# Altium project GNSS.PrjPCB
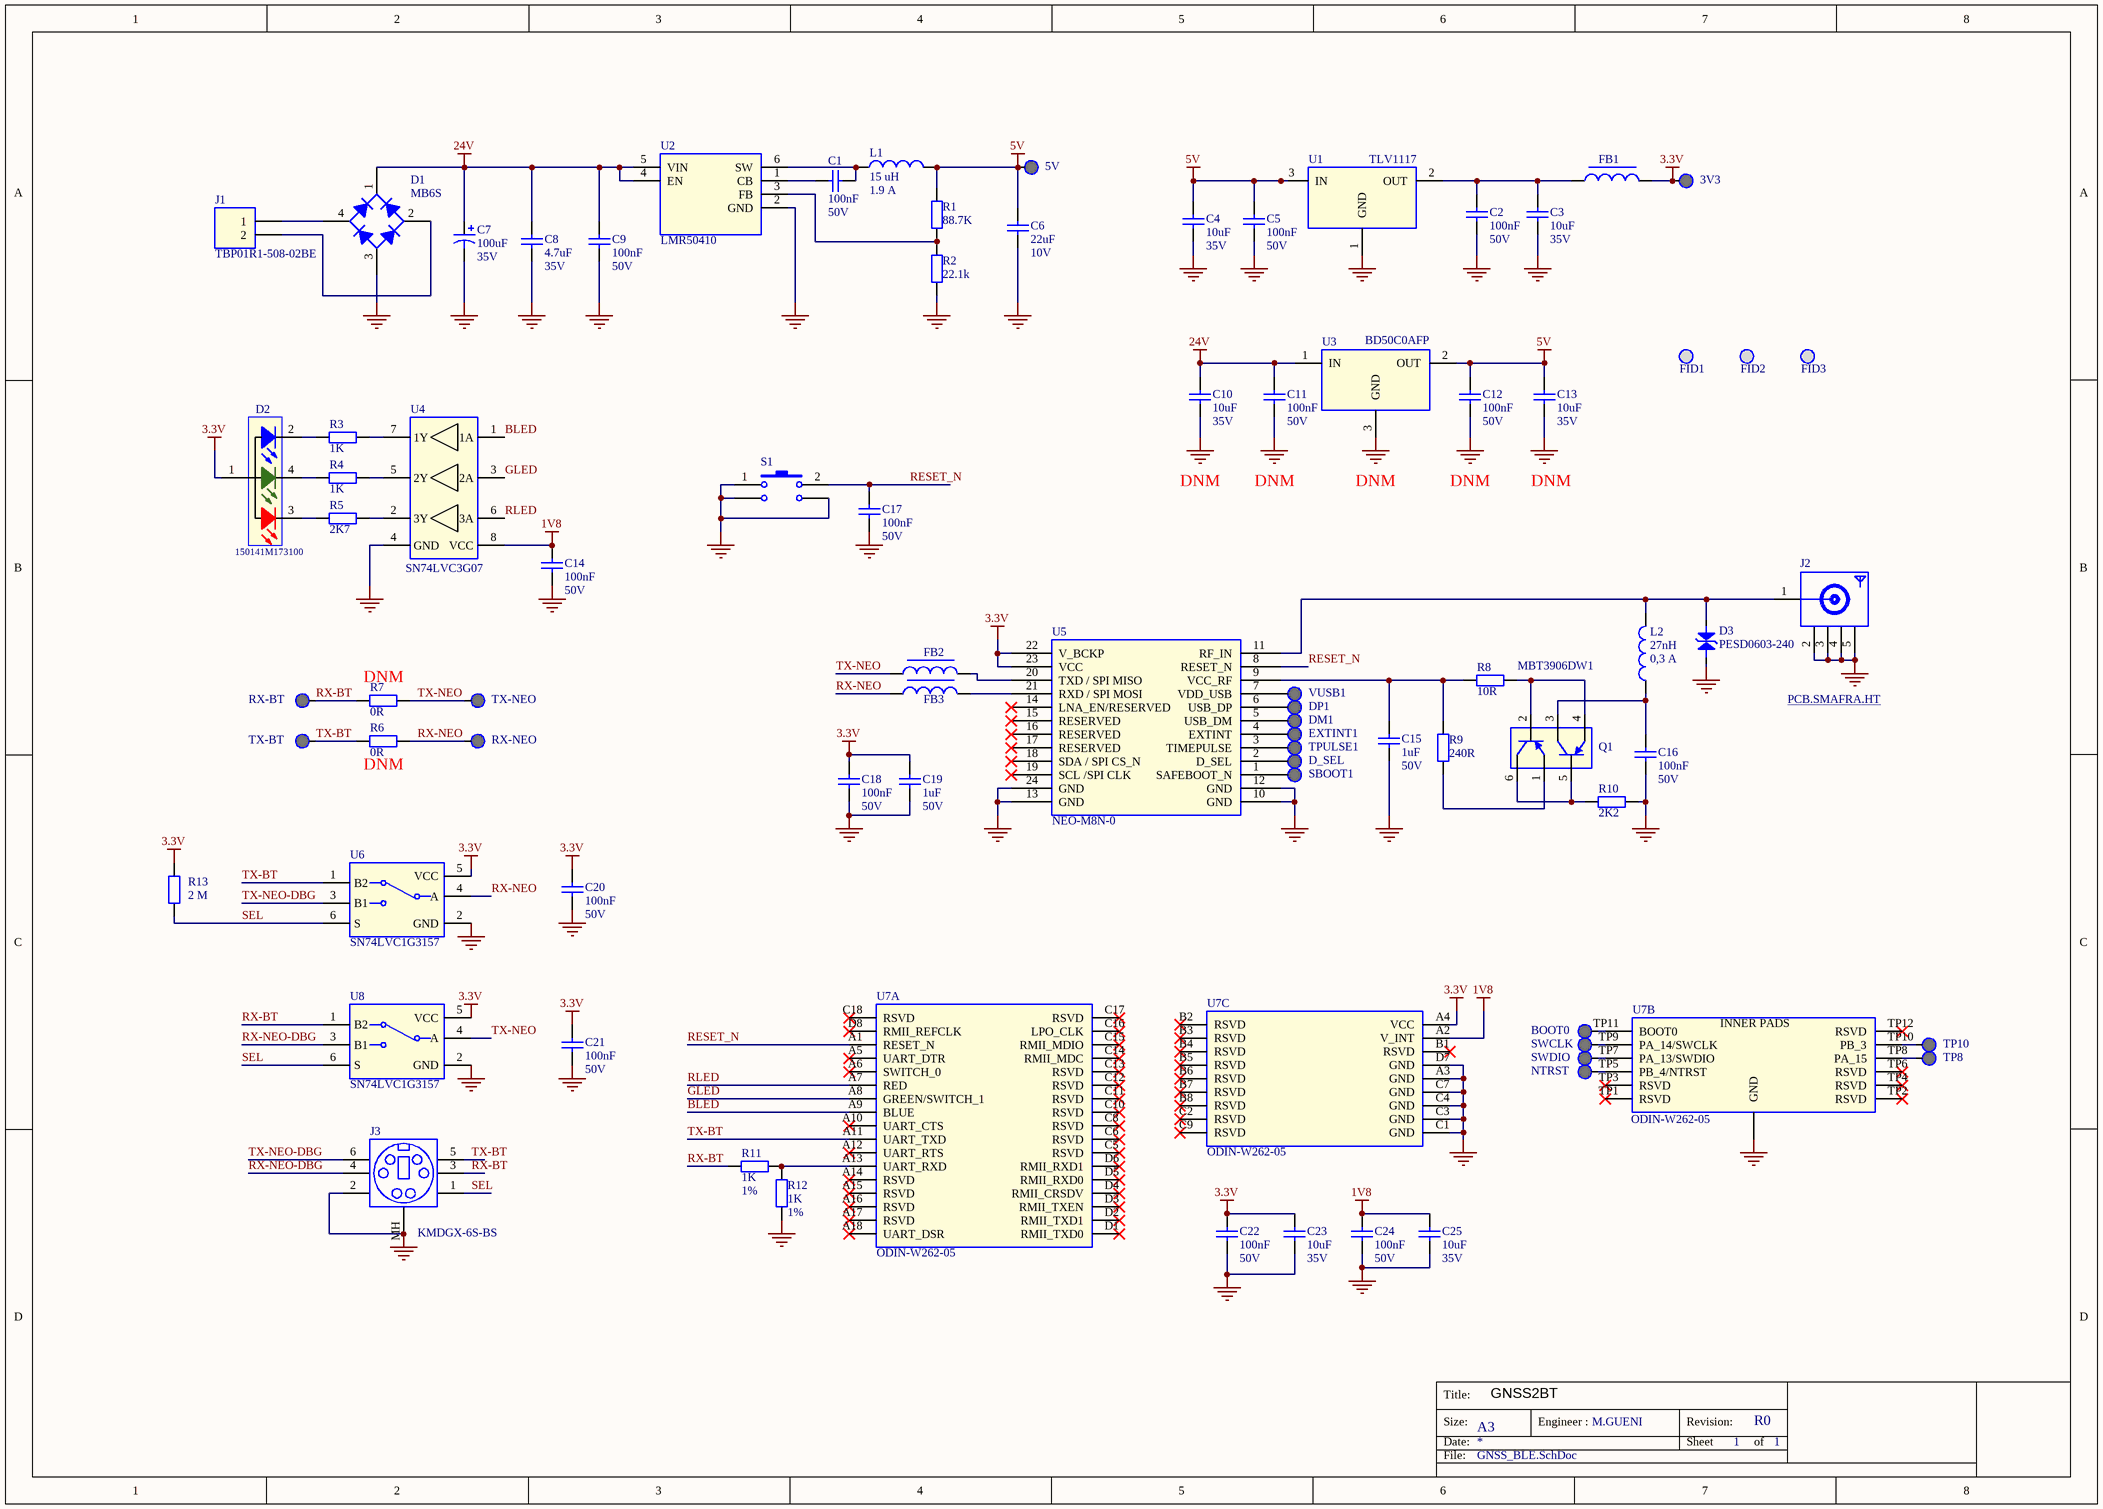
[diagram p0: GNSS_BLE.SchDoc]
CompanyName: Micro-Device Tunisie; DocumentNumber: 1; DocumentScale: 1:1; DrawnBy: MG; SheetTotal: 1; Title: DMX Wifi Bridge
1 sheet, 81 parts. Net scope: global (net labels, ports and power ports of the same name join across sheets).
Board file: GNSS_PCB.PcbDoc

## Sheet GNSS_BLE.SchDoc: DMX Wifi Bridge
size A3; Organization: Altium Limited; Address1: L3, 12a Rodborough Rd; Address2: Frenchs Forest; Address3: NSW; Address4: Australia 2086; Revision: R0; SheetNumber: 5; SheetTotal: 8

### Parts
3V3  Test Point  [TP]  (value not drawn)  (no BOM)
5V  Test Point  [TP]  (value not drawn)  (no BOM)
BOOT0  Test Point  [TP]  (value not drawn)  (no BOM)
C1  Value 1: 100nF  Value 2: 50V  [CAPC1608N]  (hidden comment: C0603C104K5RAC3121)
C2  Value 1: 100nF  Value 2: 50V  [CAPC1608N]  (hidden comment: C0603C104K5RAC3121)
C3  Value 1: 10uF  Value 2: 35V  [CAPC1608N]  (hidden comment: GRM188R6YA106MA73D)
C4  Value 1: 10uF  Value 2: 35V  [CAPC1608N]  (hidden comment: GRM188R6YA106MA73D)
C5  Value 1: 100nF  Value 2: 50V  [CAPC1608N]  (hidden comment: C0603C104K5RAC3121)
C6  Value 1: 22uF  Value 2: 10V  [CAPC1608N]  (hidden comment: GRM188R61A226ME15D)
C7  Value 1: 100uF  Value 2: 35V  [ECAP_SMD_6.3]  (hidden comment: EEEFK1V101XP)
C8  Value 1: 4.7uF  Value 2: 35V  [CAPC1608N]  (hidden comment: GRM188R6YA475KE5D)
C9  Value 1: 100nF  Value 2: 50V  [CAPC1608N]  (hidden comment: C0603C104K5RAC3121)
C10  Value 1: 10uF  Value 2: 35V  [CAPC1608N]  (hidden comment: GRM188R6YA106MA73D)
C11  Value 1: 100nF  Value 2: 50V  [CAPC1608N]  (hidden comment: C0603C104K5RAC3121)
C12  Value 1: 100nF  Value 2: 50V  [CAPC1608N]  (hidden comment: C0603C104K5RAC3121)
C13  Value 1: 10uF  Value 2: 35V  [CAPC1608N]  (hidden comment: GRM188R6YA106MA73D)
C14  Value 1: 100nF  Value 2: 50V  [CAPC1608N]  (hidden comment: C0603C104K5RAC3121)
C15  Value 1: 1uF  Value 2: 50V  [CAPC1608N]  (hidden comment: GRT188R61H105KE13D)
C16  Value 1: 100nF  Value 2: 50V  [CAPC1608N]  (hidden comment: C0603C104K5RAC3121)
C17  Value 1: 100nF  Value 2: 50V  [CAPC1608N]  (hidden comment: C0603C104K5RAC3121)
C18  Value 1: 100nF  Value 2: 50V  [CAPC1608N]  (hidden comment: C0603C104K5RAC3121)
C19  Value 1: 1uF  Value 2: 50V  [CAPC1608N]  (hidden comment: GRT188R61H105KE13D)
C20  Value 1: 100nF  Value 2: 50V  [CAPC1608N]  (hidden comment: C0603C104K5RAC3121)
C21  Value 1: 100nF  Value 2: 50V  [CAPC1608N]  (hidden comment: C0603C104K5RAC3121)
C22  Value 1: 100nF  Value 2: 50V  [CAPC1608N]  (hidden comment: C0603C104K5RAC3121)
C23  Value 1: 10uF  Value 2: 35V  [CAPC1608N]  (hidden comment: GRM188R6YA106MA73D)
C24  Value 1: 100nF  Value 2: 50V  [CAPC1608N]  (hidden comment: C0603C104K5RAC3121)
C25  Value 1: 10uF  Value 2: 35V  [CAPC1608N]  (hidden comment: GRM188R6YA106MA73D)
D1  MB6S  [MB6S]
D2  150141M173100  [150141M173100]
D3  PESD0603-240  [TVS1608]
D_SEL  Test Point  [TP]  (value not drawn)  (no BOM)
DM1  Test Point  [TP]  (value not drawn)  (no BOM)
DP1  Test Point  [TP]  (value not drawn)  (no BOM)
EXTINT1  Test Point  [TP]  (value not drawn)  (no BOM)
FB1  2512067007Y3  [FB3216]  (value not drawn)
FB2  BLM21BD102SZ1D  [FB2012]  (value not drawn)
FB3  BLM21BD102SZ1D  [FB2012]  (value not drawn)
FID1  Fiducial  [FIDUCIAL-1MM]  (value not drawn)
FID2  Fiducial  [FIDUCIAL-1MM]  (value not drawn)
FID3  Fiducial  [FIDUCIAL-1MM]  (value not drawn)
J1  TBP01R1-508-02BE  [CUI_TBP01R1-508-02BE]
J2  PCB.SMAFRA.HT  [PCB.SMAFRA.HT]
J3  KMDGX-6S-BS  [KMDGX6SBS]
L1  Value 1: 15 uH  Value 2: 1.9 A  [IND4020]  (hidden comment: 74438356150)
L2  Value 1: 27nH  Value 2: 0,3 A  [IND1608N]  (hidden comment: L0603C27NJRMST)
NTRST  Test Point  [TP]  (value not drawn)  (no BOM)
Q1  MBT3906DW1  [SOT-363-6]
R1  Value 1: 88.7K  [RESC1608N]  (hidden comment: CR0603-FX-8872ELF)
R2  Value 1: 22.1k  [RESC1608N]  (hidden comment: CRCW060322K1FKEA)
R3  Value 1: 1K  [RESC1608N]  (hidden comment: ERJ-3GEYJ102V)
R4  Value 1: 1K  [RESC1608N]  (hidden comment: ERJ-3GEYJ102V)
R5  Value 1: 2K7  [RESC1608N]  (hidden comment: RC0603JR-072K7L)
R6  Value 1: 0R  [RESC1608N]  (hidden comment: MCT06030Z0000ZP500)
R7  Value 1: 0R  [RESC1608N]  (hidden comment: MCT06030Z0000ZP500)
R8  Value 1: 10R  [RESC1608N]  (hidden comment: CRCW060310R0FKEAC)
R9  Value 1: 240R  [RESC1608N]  (hidden comment: CRCW0603240RFKEA)
R10  Value 1: 2K2  [RESC1608N]  (hidden comment: RC0603JR-072K2L)
R11  Value 1: 1K  TOL: 1%  [RESC1608N]  (hidden comment: ERJ-3GEYJ102V)
R12  Value 1: 1K  TOL: 1%  [RESC1608N]  (hidden comment: ERJ-3GEYJ102V)
R13  Value 1: 2 M  [RESC1608N]  (hidden comment: MCT06030C2004FP500)
RX-BT  Test Point  [TP]  (value not drawn)  (no BOM)
RX-NEO  Test Point  [TP]  (value not drawn)  (no BOM)
S1  1825027-8  [218250270]  (value not drawn)
SBOOT1  Test Point  [TP]  (value not drawn)  (no BOM)
SWCLK  Test Point  [TP]  (value not drawn)  (no BOM)
SWDIO  Test Point  [TP]  (value not drawn)  (no BOM)
TP8  Test Point  [TP]  (value not drawn)  (no BOM)
TP10  Test Point  [TP]  (value not drawn)  (no BOM)
TPULSE1  Test Point  [TP]  (value not drawn)  (no BOM)
TX-BT  Test Point  [TP]  (value not drawn)  (no BOM)
TX-NEO  Test Point  [TP]  (value not drawn)  (no BOM)
U1  TLV1117  [SOT223]
U2  LMR50410  [SOT-23-6]
U3  BD50C0AFP  [TO-252-3]
U4  SN74LVC3G07  [VSSOP-8]
U5  NEO-M8N-0  [NEO-M8N]
U6  SN74LVC1G3157  [SOT-23-6]
U7  ODIN-W262-05  [ODIN-W26]  (parts A,B,C of 3)
U8  SN74LVC1G3157  [SOT-23-6]
VUSB1  Test Point  [TP]  (value not drawn)  (no BOM)

### Nets
1V8: C14.1 C24.2 C25.2 U4.8(VCC) U7.A2(V_INT)
3.3V: 3V3.1 C18.1 C19.1 C20.2 C21.2 C22.2 C23.2 D2.1(A) FB1.2 R13.2 U5.22(V_BCKP) U5.23(VCC) U6.5(VCC) U7.A4(VCC) U8.5(VCC)
5V: 5V.1 C4.1 C5.1 C6.1 C12.1 C13.2 L1.2 R1.1 U1.3(IN) U3.2(OUT)
24V: C7.1 C8.1 C9.1 C10.1 C11.2 D1.1(K) U2.4(EN) U2.5(VIN) U3.1(IN)
GND: C2.2 C3.2 C4.2 C5.2 C6.2 C7.2 C8.2 C9.2 C10.2 C11.1 C12.2 C13.1 C14.2 C15.2 C16.1 C17.2 C18.2 C19.2 C20.1 C21.1 C22.1 C23.1 C24.1 C25.1 D1.3(A) D3.1 J2.2 J2.3 J2.4 J2.5 J3.2 J3.MH R2.2 R10.1 R12.1 S1.1 S1.MH U1.1(GND) U2.2(GND) U3.3(GND) U4.4(GND) U5.10(GND) U5.12(GND) U5.13(GND) U5.24(GND) U6.2(GND) U7.A3(GND) U7.C1(GND) U7.C3(GND) U7.C4(GND) U7.C7(GND) U7.D7(GND) U7.GND U8.2(GND)
BLED: U4.1(1A) U7.A9(BLUE)
GLED: U4.3(2A) U7.A8(GREEN/SWITCH_1)
RESET_N: C17.1 S1.2 U5.8(RESET_N) U7.A1(RESET_N)
RLED: U4.6(3A) U7.A7(RED)
RX-BT: J3.3 R7.2 R11.1 RX-BT.1 U8.1(B2)
RX-NEO: FB3.1 R6.1 RX-NEO.1 U6.4(A)
RX-NEO-DBG: J3.4 U8.3(B1)
SEL: J3.1 R13.1 U6.6(S) U8.6(S)
TX-BT: J3.5 R6.2 TX-BT.1 U6.1(B2) U7.A11(UART_TXD)
TX-NEO: FB2.1 R7.1 TX-NEO.1 U8.4(A)
TX-NEO-DBG: J3.6 U6.3(B1)
NetBOOT0_1: BOOT0.1 U7.TP11(BOOT0)
NetC1_1: C1.1 U2.1(CB)
NetC1_2: C1.2 L1.1 U2.6(SW)
NetC2_1: C2.1 C3.1 FB1.1 U1.2(OUT)
NetC15_1: C15.1 R8.1 R9.1 U5.9(VCC_RF)
NetC16_2: C16.2 L2.1 Q1.3(C1)
NetD1_2: D1.2(C) J1.2
NetD1_4: D1.4(C) J1.1
NetD2_2: D2.2(K) R3.2
NetD2_3: D2.3(K) R5.2
NetD2_4: D2.4(K) R4.2
NetD3_2: D3.2(K1A2) J2.1 L2.2 U5.11(RF_IN)
NetD_SEL_1: D_SEL.1 U5.2(D_SEL)
NetDM1_1: DM1.1 U5.5(USB_DM)
NetDP1_1: DP1.1 U5.6(USB_DP)
NetEXTINT1_1: EXTINT1.1 U5.4(EXTINT)
NetFB2_2: FB2.2 U5.20(TXD_/_SPI_MISO)
NetFB3_2: FB3.2 U5.21(RXD_/_SPI_MOSI)
NetNTRST_1: NTRST.1 U7.TP5(PB_4/NTRST)
NetQ1_1: Q1.1(E2) R9.2
NetQ1_2: Q1.2(B2) Q1.4(E1) R8.2
NetQ1_5: Q1.5(B1) Q1.6(C2) R10.2
NetR1_2: R1.2 R2.1 U2.3(FB)
NetR3_1: R3.1 U4.7(1Y)
NetR4_1: R4.1 U4.5(2Y)
NetR5_1: R5.1 U4.2(3Y)
NetR11_2: R11.2 R12.2 U7.A13(UART_RXD)
NetSBOOT1_1: SBOOT1.1 U5.1(SAFEBOOT_N)
NetSWCLK_1: SWCLK.1 U7.TP9(PA_14/SWCLK)
NetSWDIO_1: SWDIO.1 U7.TP7(PA_13/SWDIO)
NetTP8_1: TP8.1 U7.TP8(PA_15)
NetTP10_1: TP10.1 U7.TP10(PB_3)
NetTPULSE1_1: TPULSE1.1 U5.3(TIMEPULSE)
NetU5_7: U5.7(VDD_USB) VUSB1.1

Not connected (* = marked no-connect by the designer): U5 14(LNA_EN/RESERVED)* 15(RESERVED)* 16(RESERVED)* 17(RESERVED)* 18(SDA_/_SPI_CS_N)* 19(SCL_/SPI_CLK)*; U7 A5(UART_DTR)* A6(SWITCH_0)* A10(UART_CTS)* A12(UART_RTS)* A14(RSVD)* A15(RSVD)* A16(RSVD)* A17(RSVD)* A18(UART_DSR)* B1(RSVD)* B2(RSVD)* B3(RSVD)* B4(RSVD)* B5(RSVD)* B6(RSVD)* B7(RSVD)* B8(RSVD)* C2(RSVD)* C5(RSVD)* C6(RSVD)* C8(RSVD)* C9(RSVD)* C10(RSVD)* C11(RSVD)* C12(RSVD)* C13(RSVD)* C14(RMII_MDC)* C15(RMII_MDIO)* C16(LPO_CLK)* C17(RSVD)* C18(RSVD)* D1(RMII_TXD0)* D2(RMII_TXD1)* D3(RMII_TXEN)* D4(RMII_CRSDV)* D5(RMII_RXD0)* D6(RMII_RXD1)* D8(RMII_REFCLK)* TP1(RSVD)* TP2(RSVD)* TP3(RSVD)* TP4(RSVD)* TP6(RSVD)* TP12(RSVD)*

### Notes on the sheet
- DNM
- (near R7) DNM
- (near R6) DNM
- Title:
- GNSS2BT
- Size:
- Date:
- File:
- A3
- Engineer :
- M.GUENI
- Revision:
- Sheet
- 1
- R0
- of
- Title
- Number:
- Time:
- (in symbol RFC-000000002, part B) INNER PADS

### Library data of the parts
3V3 5V BOOT0 D_SEL DM1 DP1 EXTINT1 NTRST RX-BT RX-NEO SBOOT1 SWCLK SWDIO TP8 TP10 TPULSE1 TX-BT TX-NEO VUSB1 = MIS-000000001: MAN: _; Part Number: MIS-000000001; MANREF: _; DES: _; Value 1: _; Value 2: _; TOL: _; FTP: _; SUP: _; SUPREF: _; NOTE: _
C1 C2 C5 C9 C11 C12 C14 C16-C18 C20-C22 C24 = CAP-000000001: MAN: KEMET; DES: Condensateurs céramique multicouches MLCC - CMS 50V .1uF X7R 0603 10% AEC-Q200; TOL: 10%; FTP: 0603; SUP: Mouser; SUPREF: 80-C603C104K5RAC3121; NOTE: _; Part Number: CAP-000000001; MANREF: C0603C104K5RAC3121
C3 C4 C10 C13 C23 C25 = CAP-000000003: MAN: Murata Electronics; DES: Multilayer Ceramic Capacitors MLCC - SMD/SMT 0603 10uF 35volts *Derate Voltage/Temp; TOL: 20%; FTP: 0603; SUP: Mouser; SUPREF: 81-GRM188R6YA106MA3D; NOTE: _; Part Number: CAP-000000003; MANREF: GRM188R6YA106MA73D
C6 = CAP-000000006: MAN: Murata Electronics; DES: Multilayer Ceramic Capacitors MLCC - SMD/SMT 0603 22uF 10volts *Derate Voltage/Temp; TOL: 20%; FTP: 0603; SUP: Mouser; SUPREF: 81-GRM188R61A226ME5D; NOTE: _; Part Number: CAP-000000006; MANREF: GRM188R61A226ME15D
C7 = CAP-000000001: MAN: PANASONIC; DES: PANASONIC ELECTRONIC COMPONENTS  EEEFK1V101XP  CONDENSATEUR ELEC ALU 100UF 35V CMS; TOL: 20%; FTP: SMD Size D8; SUP: Mouser; SUPREF: 667-EEE-FK1V101XP / V101XP; NOTE: _; Part Number: CAP-000000001; MANREF: EEEFK1V101XP
C8 = CAP-000000005: MAN: Murata Electronics; DES: Multilayer Ceramic Capacitors MLCC - SMD/SMT 4.7UF 16V 10% 0603; TOL: 10%; FTP: 0603; SUP: Mouser; SUPREF: 81-GRM188R6YA475KE5D; NOTE: _; Part Number: CAP-000000005; MANREF: GRM188R6YA475KE5D
C15 C19 = CAP-000000004: MAN: Murata Electronics; DES: Condensateurs céramique multicouches MLCC - CMS 0603 50Vdc 1.0uF X5R 10%; TOL: 10%; FTP: 0603; SUP: Mouser; SUPREF: 81-GRT188R61H105KE3D; NOTE: _; Part Number: CAP-000000004; MANREF: GRT188R61H105KE13D
D1 = DIB-000000001: MAN: Micro Commercial Components (MCC); MANREF: MB6S-TP; DES: Redresseurs en pont .5A 600V; Value 1: 0.5A; Value 2: 600V; TOL: _; FTP: MBS-1; SUP: Mouser; SUPREF: 833-MB6S-TP; Part Number: DIB-000000001; NOTE: _
D2 = LED-000000001: MAN: Wurth Elektronik; DES: WL-SFTW SMD Full-color TOP LED Waterclear, size 5050, Red & Green & Blue, 120deg; Value 1: 20 mA; Value 2: 2 V, 3.2 V, 3.2 V; TOL: _; FTP: 1411 (3528 metric); SUP: Mouser; SUPREF: 710-150141M173100; Part Number: LED-000000001; MANREF: 150141M173100; NOTE: _
D3 = TVS-000000001: MAN: Littelfuse; Value 1: 24 V; Value 2: 0.25pF; TOL: _; FTP: 0603; SUP: Mouser; SUPREF: 650-PESD0603-240; DES: ESD Suppressors / TVS Diodes 0.25pFA 24V 0603 AEC-Q200; Part Number: TVS-000000001; MANREF: PESD0603-240; NOTE: _
FB1 = FER-000000001: MAN: FAIR-RITE; DES: 2512067007Y3 -  Perle de ferrite, 1206 [3216 Metric], 70 ohm, 3 A, 0.04 ohm, ± 25%; Value 1: 70Ohm; Value 2: 0R04; TOL: 25%; FTP: 1206; SUP: Mouser; SUPREF: 623-2512067007Y3; NOTE: _; Part Number: FER-000000001; MANREF: 2512067007Y3
FB2 FB3 = FER-000000002: MAN: Murata Electronics; DES: Ferrite Beads 0805 1000ohms 250mA Auto Infotainment; Value 1: 1K; Value 2: 250mA; TOL: 25%; FTP: 0805; SUP: Mouser; SUPREF: 81-BLM21BD102SZ1D; NOTE: _; Part Number: FER-000000002; MANREF: BLM21BD102SZ1D
FID1-FID3 = MIS-000000002: MAN: _; Value 1: 1mm; Part Number: MIS-000000002; MANREF: _; DES: _; Value 2: _; TOL: _; FTP: _; SUP: _; SUPREF: _; NOTE: _
J1 = CON-000000001: MAN: CUI Devices; MANREF: TBP01R1-508-02BE / 39910-0102; DES: Pluggable Terminal Blocks Terminal block, pluggable, 5.08, receptical, 2 pole, blue; Value 1: 2pts; Value 2: 5.08 mm; TOL: _; FTP: THT; SUP: Mouser; SUPREF: 490-TBP01R1-508-02BE; Part Number: CON-000000001; NOTE: _
J2 = CON-000000003: MAN: Taoglas; DES: Connecteurs RF / Connecteurs coaxiaux SMA RA PCB Mount, Jack, Gold, 50 , Through Hole Pin; Value 1: 5pts; Value 2: _; FTP: THT; SUP: Mouser; SUPREF: 960-PCB.SMAFRA.HT; Part Number: CON-000000003; MANREF: PCB.SMAFRA.HT; TOL: _; NOTE: _
J3 = CON-000000002: MAN: Kycon; DES: Circular DIN Connectors 6P R/A FULL SHIELD GOLD PLANTED; Value 1: 6pts; Value 2: _; FTP: THT; SUP: Mouser; SUPREF: 806-KMDGX-6S-BS; Part Number: CON-000000002; MANREF: KMDGX-6S-BS; TOL: _; NOTE: _
L1 = IND-000000001: MAN: Wurth Elektronik; DES: Fixed Inductors WE-MAPI 15uH 1.9A DCR=230mOhms AECQ200; TOL: 20%; FTP: 4020; SUP: Mouser; SUPREF: 710-74438356150; NOTE: _; Part Number: IND-000000001; MANREF: 74438356150
L2 = IND-000000002: MAN: KEMET; DES: Fixed Inductors 27nH 300mA 5%; TOL: 5 %; FTP: 0603; SUP: Mouser; SUPREF: 80-L0603C27NJRMST; NOTE: _; Part Number: IND-000000002; MANREF: L0603C27NJRMST
Q1 = TRP-000000001: MAN: ON Semiconductor; DES: Bipolar Transistors - BJT SS GP XSTR PNP 40V; Value 1: - 40 V; Value 2: 0.2 A; TOL: _; SUP: Mouser; SUPREF: 863-MBT3906DW1T1G; Part Number: TRP-000000001; MANREF: MBT3906DW1T1G; FTP: SOT-363-6; NOTE: _
R1 = RES-000000007: MAN: Bourns; DES: Résistances à couches épaisses - CMS 88.7K ohm 1%; Value 2: 0.1W; TOL: 1%; FTP: 0603; SUP: Mouser; SUPREF: 652-CR0603FX-8872ELF; NOTE: _; Part Number: RES-000000007; MANREF: CR0603-FX-8872ELF
R2 = RES-000000006: MAN: Vishay / Dale; DES: Résistances à couches épaisses - CMS 1/10watt 22.1Kohms 1%; Value 2: 0.1W; TOL: 1%; FTP: 0603; SUP: Mouser; SUPREF: 71-CRCW0603-22.1K-E3; NOTE: _; Part Number: RES-000000006; MANREF: CRCW060322K1FKEA
R3 R4 = RES-000000001: MAN: Panasonic; DES: Résistances à couches épaisses - CMS 0603 1Kohms 5% AEC-Q200; Value 2: 0.1W; TOL: 1%; FTP: 0603; SUP: Mouser; SUPREF: 667-ERJ-3GEYJ102V; NOTE: _; Part Number: RES-000000001; MANREF: ERJ-3GEYJ102V
R5 = RES-000000009: MAN: YAGEO; DES: Résistances à couches épaisses - CMS 2.7K OHM 5%; Value 2: 0.1W; TOL: 5%; FTP: 0603; SUP: Mouser; SUPREF: 603-RC0603JR-072K7L; NOTE: _; Part Number: RES-000000009; MANREF: RC0603JR-072K7L
R6 R7 = RES-000000004: MAN: Vishay / Beyschlag; DES: Thin Film Resistors - SMD Zero ohm Jumper; Value 2: 0.125W; TOL: _; FTP: 0603; SUP: Mouser; SUPREF: 594-MCT06030Z0000ZP5; Part Number: RES-000000004; MANREF: MCT06030Z0000ZP500; NOTE: _
R8 = RES-000000002: MAN: Vishay / Dale; DES: Résistances à couches épaisses - CMS 1/10Watt 10ohms 1% Commercial Use; Value 2: 0.1W; TOL: 1%; FTP: 0603; SUP: Mouser; SUPREF: 71-CRCW060310R0FKEAC; NOTE: _; Part Number: RES-000000002; MANREF: CRCW060310R0FKEAC
R9 = RES-000000005: MAN: Vishay / Dale; DES: Résistances à couches épaisses - CMS 1/10watt 240ohms 1%; Value 2: 0.1W; TOL: 1%; FTP: 0603; SUP: Mouser; SUPREF: 71-CRCW0603-240-E3; NOTE: _; Part Number: RES-000000005; MANREF: CRCW0603240RFKEA
R10 = RES-000000003: MAN: YAGEO; DES: Résistances à couches épaisses - CMS 2.2K OHM 5%; Value 2: 0.1W; TOL: 5%; FTP: 0603; SUP: Mouser; SUPREF: 603-RC0603JR-072K2L; NOTE: _; Part Number: RES-000000003; MANREF: RC0603JR-072K2L
R11 R12 = RES-000000001: MAN: Panasonic; DES: Résistances à couches épaisses - CMS 0603 1Kohms 5% AEC-Q200; Value 2: 0.1W; FTP: 0603; SUP: Mouser; SUPREF: 667-ERJ-3GEYJ102V; NOTE: _; Part Number: RES-000000001; MANREF: ERJ-3GEYJ102V
R13 = RES-000000008: MAN: Vishay / Beyschlag; DES: Thin Film Resistors .1W 2Mohms 1% 0603 50ppm; Value 2: 0.125W; TOL: 1%; FTP: 0603; SUP: Mouser; SUPREF: 594-MCT06030C2004FP5; NOTE: _; Part Number: RES-000000008; MANREF: MCT06030C2004FP500
S1 = SWC-000000001: MAN: TE Connectivity / P&B; DES: Tactile Switches R/A TACT 160G PB SWITCH; Value 1: _; FTP: THT; SUP: Mouser; SUPREF: 506-1825027-8; Part Number: SWC-000000001; MANREF: 1825027-8; Value 2: _; TOL: _; NOTE: _
U1 = VRG-000000001: MAN: Texas Instrument; MANREF: TLV1117LV33DCYR; DES: TEXAS INSTRUMENTS  TLV1117LV33DCYR  LDO FIXE 3.3V 1A SOT-223-4; Value 1: 3.3V; Value 2: 1A; TOL: _; FTP: SOT-223; SUP: Mouser; SUPREF: 595-TLV1117LV33DCYR; Part Number: VRG-000000001; NOTE: _
U2 = ICP-000000001: MAN: Texas Instruments; MANREF: LMR50410YQDBVRQ1; DES: Switching Voltage Regulators Automotive qualified SIMPLE SWITCHER 4-V to 36-V, 1-A synchronous step-down converter 6-SOT-23 -40 to 150; Value 1: 36 V; Value 2: 1 A; TOL: _; SUP: Mouser; SUPREF: 595-LMR50410YQDBVRQ1; Part Number: ICP-000000001; FTP: SOT-23-6; NOTE: _
U3 = VRG-000000003: MAN: ROHM Semiconductor; MANREF: BD50C0AFP-CE2; DES: LDO Voltage Regulators 4-26.5V TO252-3 15A LDO Regulator; Value 1: 5V; Value 2: 1A; TOL: _; SUP: Mouser; SUPREF: 755-BD50C0AFP-CE2; Part Number: VRG-000000003; FTP: TO-252-3; NOTE: _
U4 = ICD-000000001: MAN: TEXAS INSTRUMENTS; MANREF: SN74LVC3G07DCUR; DES: Buffers & Line Drivers Triple w/ OD; Value 1: 5.5 V; Value 2: _; SUP: Mouser; SUPREF: 595-SN74LVC3G07DCUR; Part Number: ICD-000000001; TOL: _; FTP: VSSOP-8; NOTE: _
U5 = RFC-000000001: MAN: U-Blox; DES: NEO-M8 RF Receiver BeiDou, Galileo, GLONASS, GNSS, GPS 1.575GHz -167dBm; Value 1: _; SUP: Digi-Key; SUPREF: 672-NEO-M8N-0TR-ND; Part Number: RFC-000000001; MANREF: NEO-M8N-0; Value 2: _; TOL: _; FTP: _; NOTE: _
U6 U8 = GIC-000000001: MAN: Texas Instruments; MANREF: SN74LVC1G3157DBVR; DES: Analogue Switch ICs SPDT Analog Switchc; Value 1: 5.5 V; Value 2: _; SUP: Mouser; SUPREF: 595-SN74LVC1G3157DBV; Part Number: GIC-000000001; TOL: _; FTP: SOT-23-6; NOTE: _
U7 = RFC-000000002: MAN: U-Blox; MANREF: ODIN-W262-05B; DES: RX TXRX MODULE WIFI CHIP SMD; Value 1: _; SUP: Digi-Key; SUPREF: 672-ODIN-W262-05BTR-ND; Part Number: RFC-000000002; Value 2: _; TOL: _; FTP: _; NOTE: _

## Assembly variants
Variant of GNSS: not fitted C10 C11 C12 C13 R6 R7 U3